# EAGLE design ud100v1 (EAGLE 9.6.2)
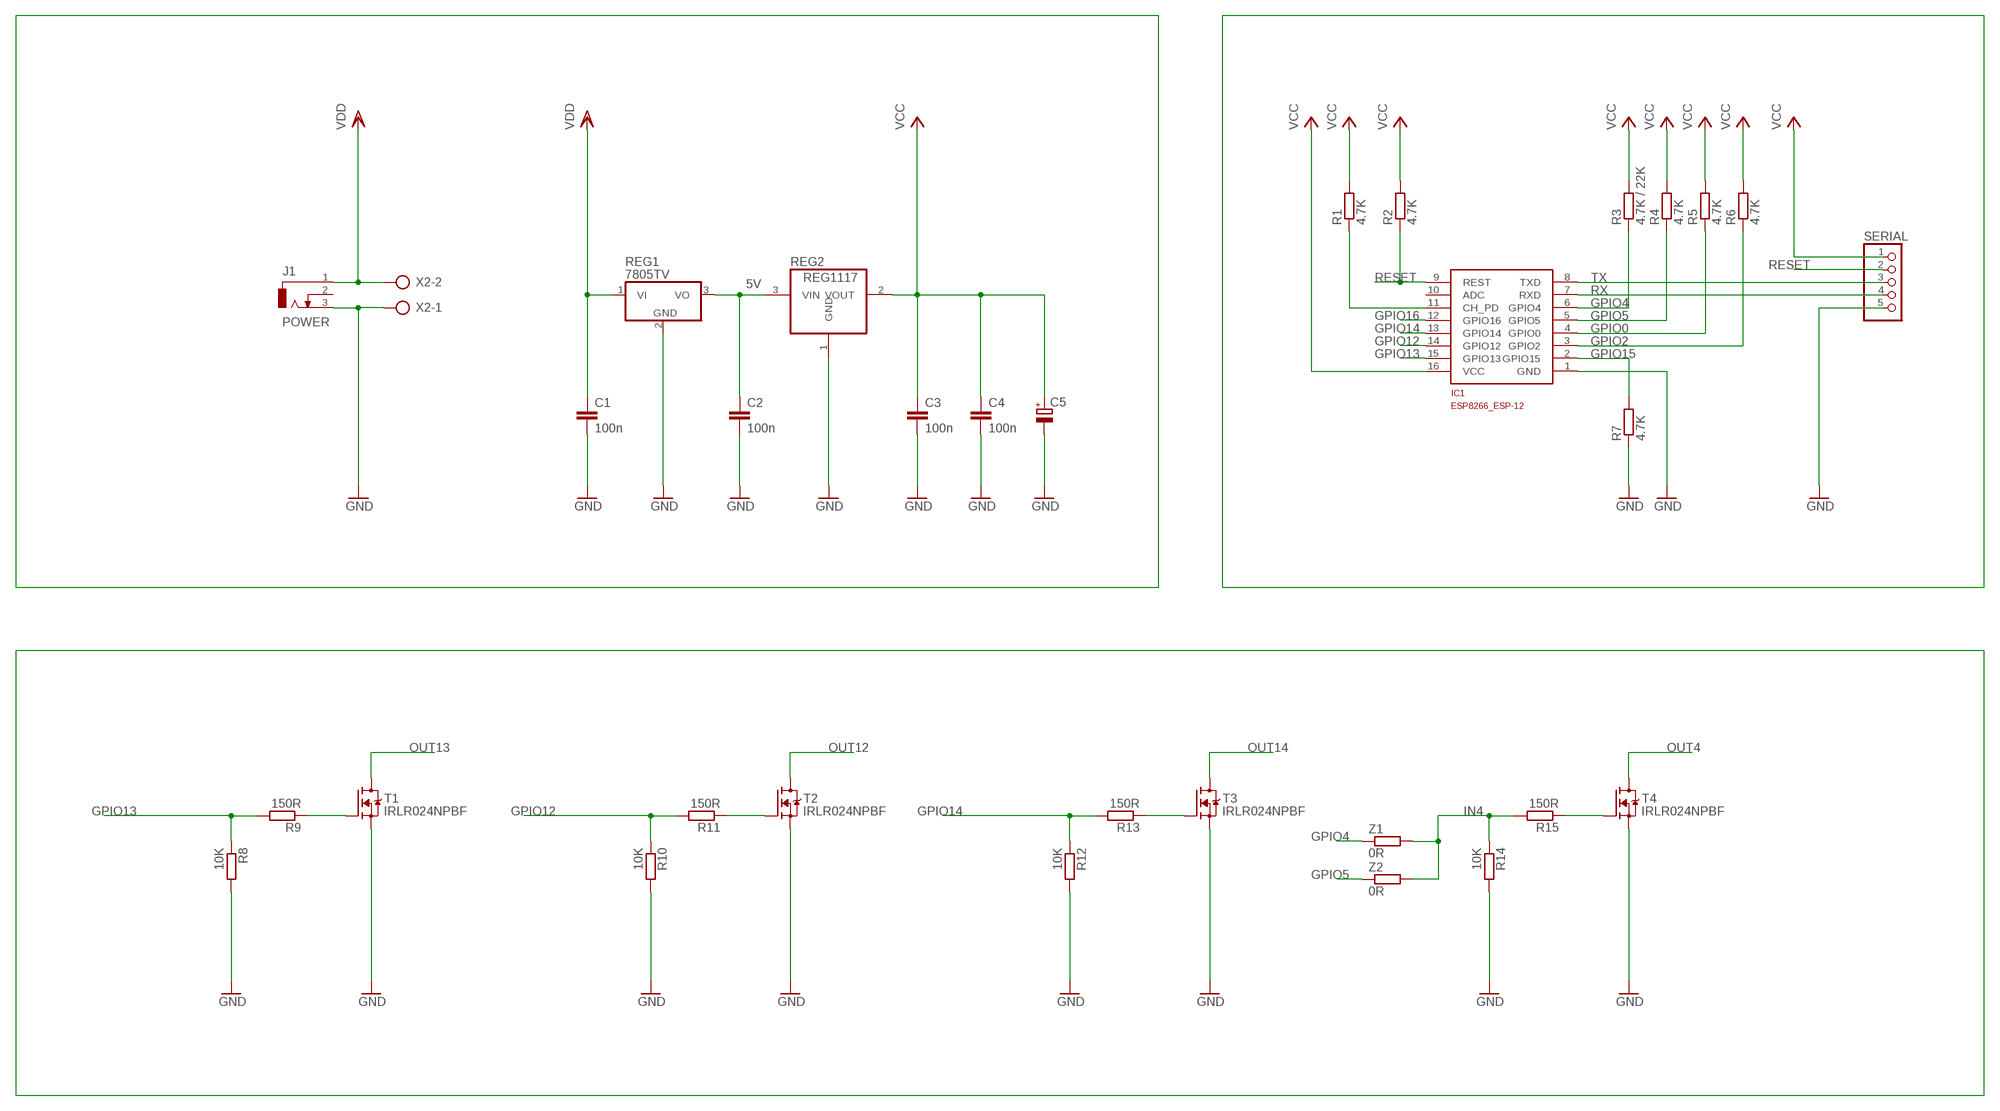
[diagram p0: schematic, sheet 1, part 1 of 2]
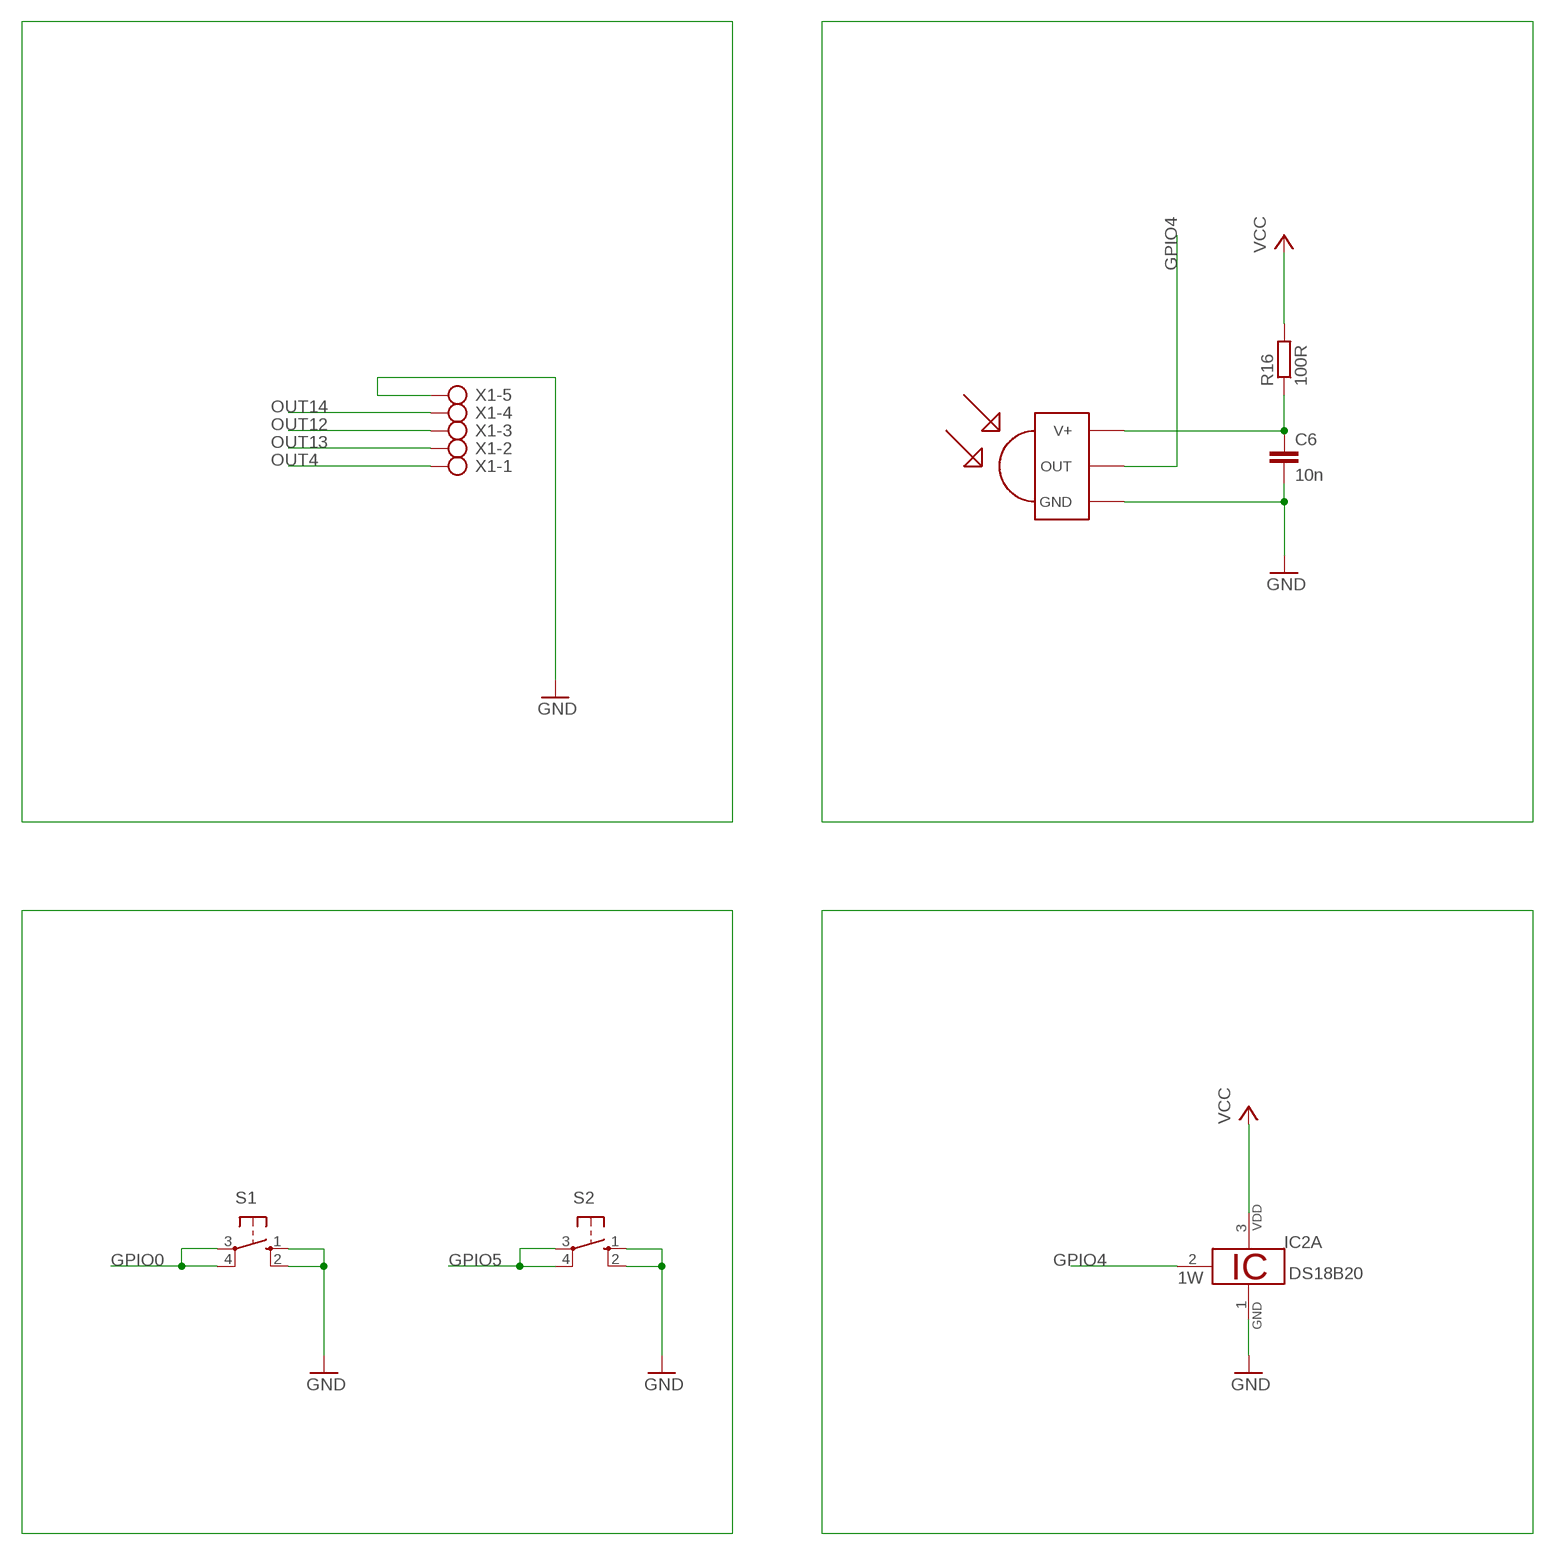
[diagram p1: schematic, sheet 1, part 2 of 2]

## Parts
C1  100n  C-EUC1206  [C1206]
C2  100n  C-EUC1206  [C1206]
C3  100n  C-EUC1206  [C1206]
C4  100n  C-EUC1206  [C1206]
C5  CPOL-EUUD-6,3X8,8  [UD-6,3X5,8_NICHICON]
C6  10n  C-EUC1206  [C1206]
IC1  ESP8266_ESP-12  [ESP8266-ESP12]
IC2  DS18B20  [TO92-]
J1  POWER  DCJ0303  [DCJ0303]
R1  4.7K  R-EU_R1206  [R1206]
R2  4.7K  R-EU_R1206  [R1206]
R3  4.7K / 22K  R-EU_R1206  [R1206]
R4  4.7K  R-EU_R1206  [R1206]
R5  4.7K  R-EU_R1206  [R1206]
R6  4.7K  R-EU_R1206  [R1206]
R7  4.7K  R-EU_R1206  [R1206]
R8  10K  R-EU_R1206  [R1206]
R9  150R  R-EU_R1206  [R1206]
R10  10K  R-EU_R1206  [R1206]
R11  150R  R-EU_R1206  [R1206]
R12  10K  R-EU_R1206  [R1206]
R13  150R  R-EU_R1206  [R1206]
R14  10K  R-EU_R1206  [R1206]
R15  150R  R-EU_R1206  [R1206]
R16  100R  R-EU_R1206  [R1206]
REG1  7805TV  [TO220V]
REG2  REG1117  [SOT223]
S1  10-XX  [B3F-10XX]
S2  10-XX  [B3F-10XX]
SERIAL  PINHD-1X5  [1X05]
T1  IRLR024NPBF  MOSFET-N-DPAK  [DPAK_TO252]
T2  IRLR024NPBF  MOSFET-N-DPAK  [DPAK_TO252]
T3  IRLR024NPBF  MOSFET-N-DPAK  [DPAK_TO252]
T4  IRLR024NPBF  MOSFET-N-DPAK  [DPAK_TO252]
U$1  TSOP1736  [TSOP17XX]
X1  AK500/5  [AK500/5]
X2  AK500/2  [AK500/2]
Z1  0R  R-EU_R0805  [R0805]
Z2  0R  R-EU_R0805  [R0805]

## Nets
5V: C2.1 REG1.3(VO) REG2.3(VIN)
GND: C1.2 C2.2 C3.2 C4.2 C5.- C6.2 IC1.1(GND) IC2.1 J1.3 R7.1 R8.2 R10.2 R12.2 R14.2 REG1.2(GND) REG2.1(GND) S1.1(S) S1.2(S1) S2.1(S) S2.2(S1) SERIAL.5 T1.3(S) T2.3(S) T3.3(S) T4.3(S) U$1.GND X1.5 X2.1
GPIO0: IC1.4(GPIO0) R5.1 S1.3(P) S1.4(P1)
GPIO2: IC1.3(GPIO2) R6.1
GPIO4: IC1.6(GPIO4) IC2.2 R3.1 U$1.OUT Z1.1
GPIO5: IC1.5(GPIO5) R4.1 S2.3(P) S2.4(P1) Z2.1
GPIO12: IC1.14(GPIO12) R10.1 R11.2
GPIO13: IC1.15(GPIO13) R8.1 R9.2
GPIO14: IC1.13(GPIO14) R12.1 R13.2
GPIO15: IC1.2(GPIO15) R7.2
GPIO16: IC1.12(GPIO16)
IN4: R14.1 R15.2 Z1.2 Z2.2
N$3: R15.1 T4.1(G)
N$5: IC1.11(CH_PD) R1.1
N$7: C6.1 R16.1 U$1.V+
N$8: R13.1 T3.1(G)
N$11: R9.1 T1.1(G)
N$13: R11.1 T2.1(G)
OUT4: T4.2(D) X1.1
OUT12: T2.2(D) X1.3
OUT13: T1.2(D) X1.2
OUT14: T3.2(D) X1.4
RESET: IC1.9(REST) R2.1 SERIAL.2
RX: IC1.7(RXD) SERIAL.4
TX: IC1.8(TXD) SERIAL.3
VCC: C3.1 C4.1 C5.+ IC1.16(VCC) IC2.3 R1.2 R2.2 R3.2 R4.2 R5.2 R6.2 R16.2 REG2.2(VOUT) SERIAL.1
VDD: C1.1 J1.1 REG1.1(VI) X2.2
Unconnected: IC1.10(ADC) J1.2

## Library data of the parts
C1-C4 C6 = rcl:C-EU: CAPACITOR, European symbol; SPICEPREFIX: C
C5 = rcl:CPOL-EU: POLARIZED CAPACITOR, European symbol; SPICEPREFIX: C
IC1 = ESP8266-ESP12:ESP8266_ESP-12
IC2 = 1wire:DS18B20: Programmable Resolution Digital Thermometer This chip provides a onewire thermosensor with approx. 0.5°C accuracy. A programmable over/undertemperure alarm is available. The precision can be set from 9..12 bits. Notes: Vdd must be applied for accurate measurements at low temperatures, as the parasite power circuit otherwise heats the sensor. If parasite power is used, Vdd has to be connected to GND. The DS1822 is a low-cost thermometer chip, the DS18S20 is similar to the DS18B20, but with 9 Bit precision only. Author: Jan Kandziora <jjj@gmx.de>
J1 = con-jack:DCJ0303: DC POWER JACK Source: DCJ0303.pdf; OC_FARNELL: unknown; OC_NEWARK: unknown
R1-R16 Z1 Z2 = rcl:R-EU_: RESISTOR, European symbol; SPICEPREFIX: R
REG1 = linear:78*: Positive VOLTAGE REGULATOR Source: http://cache.national.com/ds/LM/LM78L05.pdf http://www.fairchildsemi.com/ds/LM/LM7805.pdf
REG2 = burr-brown:REG1117: 800mA and 1A Low Dropout (LDO) Positive Regulator 1.8V, 2.5V, 2.85V, 3.3V, 5V, and Adj; MPN: REG1117; OC_FARNELL: 1097566; OC_NEWARK: 14P6981
S1 S2 = switch-omron:10-XX: OMRON SWITCH; MPN: B3F-1000; OC_FARNELL: 176432; OC_NEWARK: 36M3542
SERIAL = pinhead:PINHD-1X5: PIN HEADER
T1-T4 = we-transistor:MOSFET-N: N-Channel MOSFET SOT23 N-Chn MOSFET TSM3404, IRLML2502 (Vgs>=+/-20V, Vds<=20V, Id>=3A + Rds<=0.05Ohm @ Vgs=4.5V) BSS138 (Vgs>=+/-20V, Vds<=40V, Id>=0.2A + Rds<=3Ohm @ Vgs=4.5V) SOT223 Low Side Switch with Protection (Infineon) BSP76 (Vin=0...10V, Vds<=42V, Id=1.4A + Rds=0.2Ohm @ Vin=5V) BSP77 (Vin=0...10V, Vds<=42V, Id=2.2A + Rds=0.1Ohm @ Vin=5V) D²Pak Low Side Switch with Protection (Infineon) BTS117TC (Vin=0...10V, Vds<=60V, Id=3.5A + Rds=0.12Ohm @ Vin=5V) BTS133TC (Vin=0...10V, Vds<=60V, Id=7A + Rds=0.06Ohm @ Vin=5V) BTS141TC (Vin=0...10V, Vds<=60V, Id=12A + Rds=0.03Ohm @ Vin=5V) BTS3018TC (Vin=0...10V, Vds<=60V, Id=6A + Rds=0.02Ohm @ Vin=5V)
U$1 = tsop:TSOP1736: IR Receiver and Demodulator
X1 = con-ptr500:AK500/5: CONNECTOR; OC_FARNELL: unknown; OC_NEWARK: unknown
X2 = con-ptr500:AK500/2: CONNECTOR; OC_FARNELL: unknown; OC_NEWARK: unknown

## Board
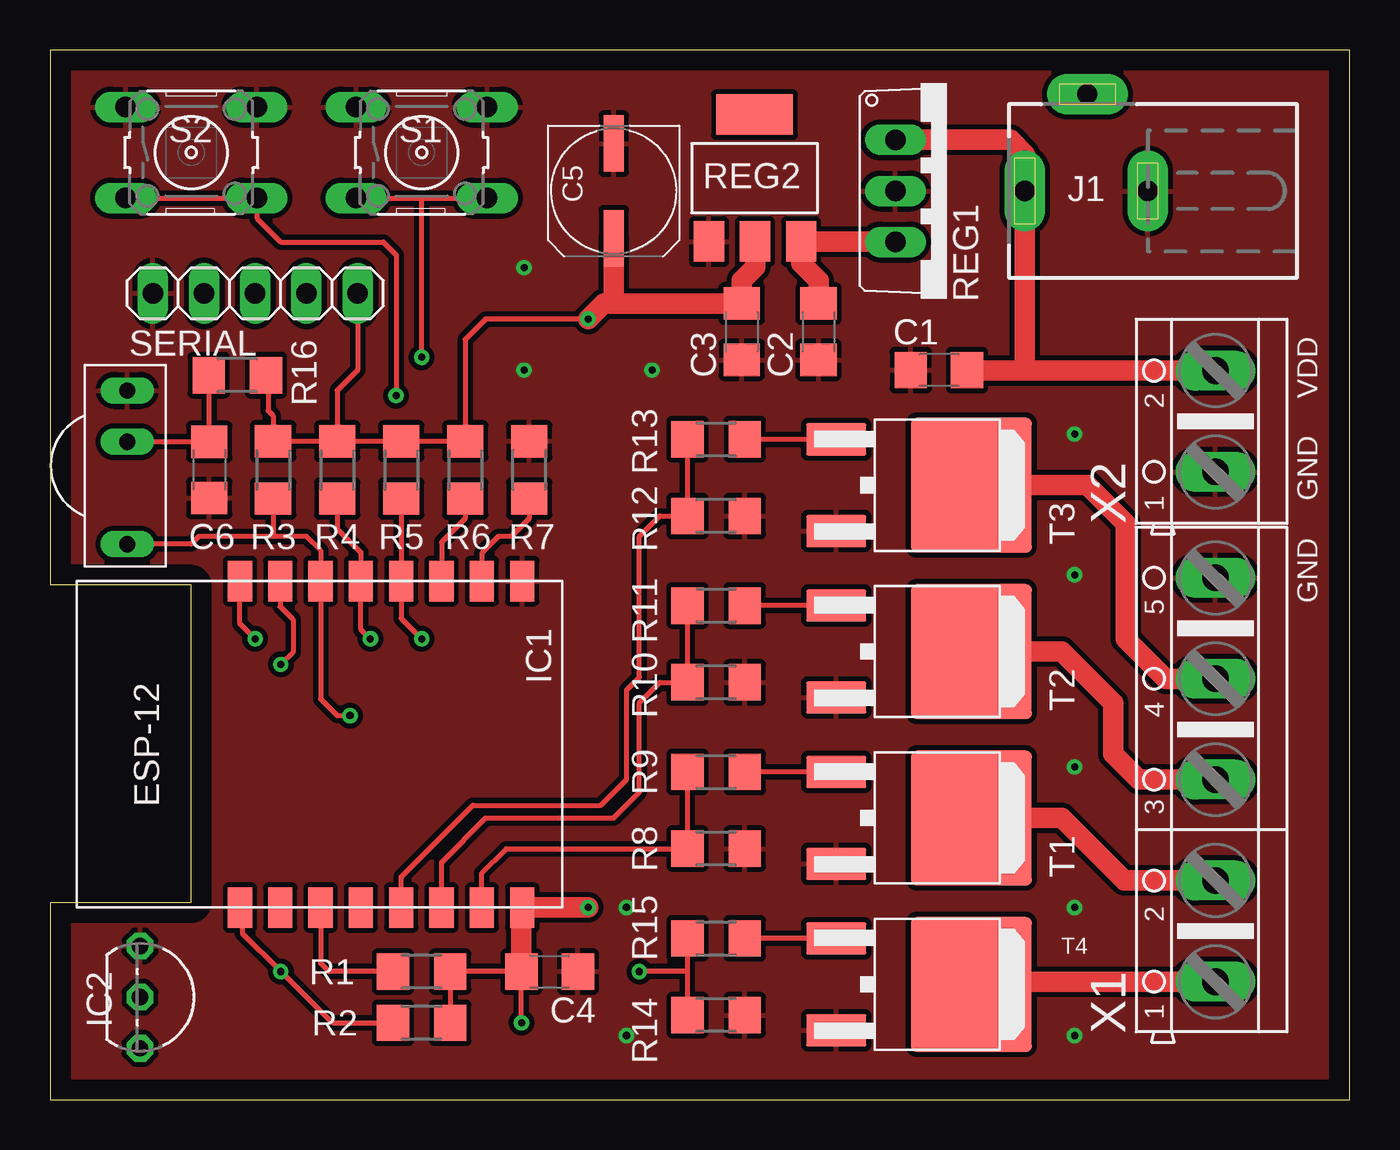
[diagram p2: board, top side]
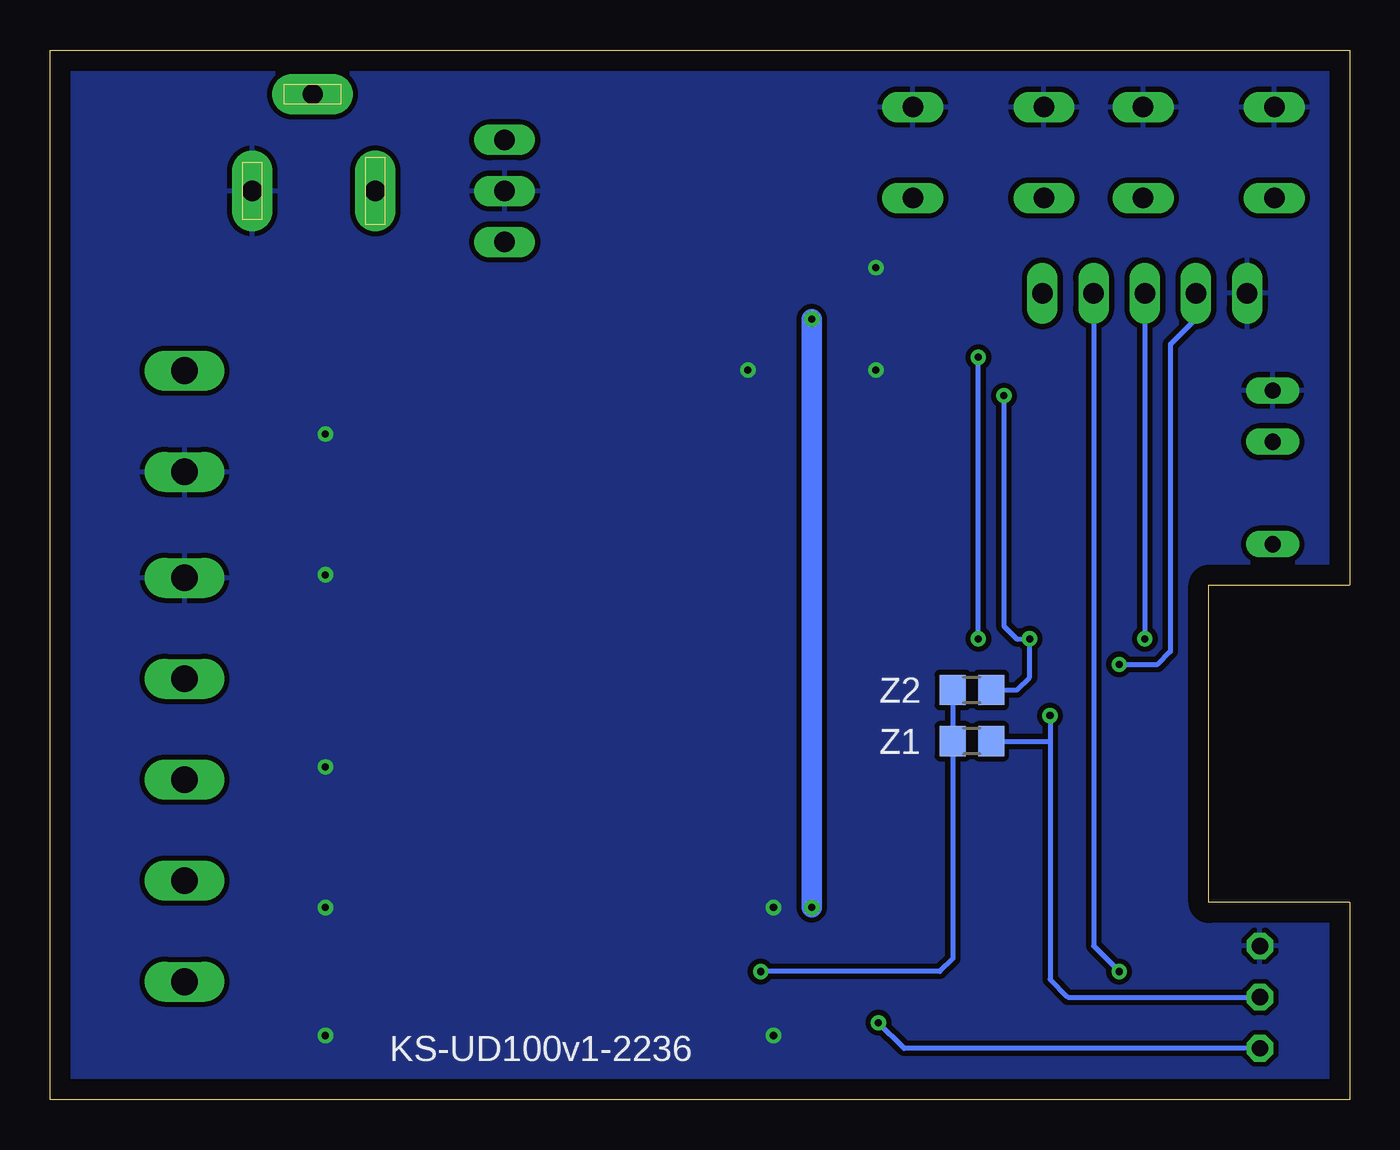
[diagram p3: board, bottom side, seen from below]

Size 64.44 x 52.06 mm. Coordinates in mm from the lower left corner, seen from the top.
Outline: 0,0 64.44,0 64.44,52.06 0,52.06 0,25.53 6.99,25.53 6.99,9.78 0,9.78 0,0
Copper layers (1*16): Top 0.035mm / dielectric 1.5mm / Bottom 0.035mm
Design rules "default *": minimum track width 10mil, minimum drill 0.35mm, track to track 10mil, track to pad 10mil, pad to pad 10mil, via to via 10mil, smd to smd 10mil, copper to edge 40mil, drill to drill 10mil, minimum pad ring 10mil, minimum via ring 8mil, stop-mask expansion 4mil, vias tented up to drill 0mil, thermal gap 10mil

### Footprints (pad centres in the part's own frame; a part is rotated, then mirrored left to right if it is on the bottom)
C1206 = smd 1.6 x 1.8: 1 -1.4,0; 2 1.4,0
UD-6,3X5,8_NICHICON = smd 2.8 x 1: + 2.35,0; - -2.35,0
ESP8266-ESP12 = smd 2 x 1.2: 1 16.2,2; 2 16.2,4; 3 16.2,6; 4 16.2,8; 5 16.2,10; 6 16.2,12; 7 16.2,14; 8 16.2,16; 9 0,16; 10 0,14; 11 0,12; 12 0,10; 13 0,8; 14 0,6; 15 0,4; 16 0,2
TO92- = drill 0.813 octagon: 1 -2.54,0; 2 0,0; 3 2.54,0
DCJ0303 = drill 1 pad 2 long: 1 0,3.1; 2 4.8,0; 3 0,-3
R1206 = smd 1.6 x 1.803: 1 -1.422,0; 2 1.422,0
TO220V = drill 1.016 long: 1 -2.54,-2.54; 2 0,-2.54; 3 2.54,-2.54
SOT223 = smd 1.499 x 2.007: 1 -2.261,-3.15; 2 0.025,-3.15; 3 2.311,-3.15 | smd 3.81 x 2.007: 4 0,3.15
B3F-10XX = drill 1.016 long: 1 -3.251,2.261; 2 3.251,2.261; 3 -3.251,-2.261; 4 3.251,-2.261
1X05 = drill 1.016 long: 1 -5.08,0; 2 -2.54,0; 3 0,0; 4 2.54,0; 5 5.08,0
DPAK_TO252 = smd 3 x 1.6: 1 -4.2,2.28; 3 -4.2,-2.28 | smd 6 x 6.7: 2 2.5,0
TSOP17XX = drill 0.813 long: GND -3.81,0; OUT 3.81,0; V+ -1.27,0
AK500/5 = drill 1.321 long: 1 -10.033,0; 2 -5.004,0; 3 0,0; 4 5.004,0; 5 10.008,0
AK500/2 = drill 1.321 long: 1 -2.515,0; 2 2.515,0
R0805 = smd 1.3 x 1.5: 1 -0.95,0; 2 0.95,0

### Placement (x,y rotation side)
C1  44.07,36.2 180 top
C2  38.1,38.1 270 top
C3  34.29,38.1 270 top
C4  24.77,6.35 0 top
C5  27.94,45.09 270 top
C6  7.87,31.24 270 top
IC1  25.4,9.53 90 top
IC2  4.45,5.08 270 top
J1  51.44,45.09 90 top
R1  18.41,6.35 0 top
R2  18.41,3.81 0 top
R3  11.05,31.24 90 top
R4  14.22,31.24 90 top
R5  17.4,31.24 90 top
R6  20.57,31.24 90 top
R7  23.75,31.24 270 top
R8  33.02,12.45 0 top
R9  33.02,16.26 180 top
R10  33.02,20.7 0 top
R11  33.02,24.51 180 top
R12  33.02,28.96 0 top
R13  33.02,32.77 180 top
R14  33.02,4.19 0 top
R15  33.02,8 180 top
R16  9.27,35.94 0 top
REG1  44.45,45.09 270 top
REG2  34.92,45.72 0 top
S1  18.41,46.99 0 top
S2  6.99,46.99 0 top
SERIAL  10.16,40.01 180 top
T1  43.18,13.97 0 top
T2  43.18,22.23 0 top
T3  43.18,30.48 0 top
T4  43.18,5.71 0 top
U$1  3.81,31.37 270 top
X1  57.78,15.88 90 top
X2  57.78,33.66 90 top
Z1  18.73,17.78 180 bottom
Z2  18.73,20.32 180 bottom

### Tracks (layer width: path | path; a pad name or v marks a point on that pad's centre or on a via)
5V
  Top 1.016: C2.1 38.1,40.64 37.24,41.5 REG2.3 41.88,42.57 REG1.3
GND  (via drill 0.35)
  other vias: 50.8,33.02 50.8,26.04 50.8,16.51 50.8,9.53 50.8,3.17 28.57,9.53 28.57,3.17 29.84,36.2 23.5,36.2 23.5,41.27
  pour Top: 0,0 64.14,0 64.14,52.07 0,52.07 0,26.04 7.62,26.04 7.62,9.53 0,9.53
  pour Bottom: 0,0 64.14,0 64.14,52.07 0,52.07 0,26.04 7.62,26.04 7.62,9.53 0,9.53
GPIO0  (via drill 0.35)
  Top 0.254: S1.3 18.41,44.73 | 18.41,44.73 S1.4 | R5.1 IC1.4 17.4,23.88 v18.41,22.86 | v18.41,36.83 18.41,44.73
  Bottom 0.254: v18.41,22.86 v18.41,36.83
GPIO2
  Top 0.254: R6.1 20.57,28.83 19.4,27.66 IC1.3
GPIO4  (via drill 0.35)
  Top 0.254: R3.1 11.05,27.94 | v14.86,19.05 14.22,19.05 13.4,19.87 IC1.6 13.4,27.24 12.7,27.94 11.05,27.94 | U$1.OUT 6.99,27.56 7.37,27.94 11.05,27.94
  Bottom 0.254: v14.86,19.05 14.86,17.78 | 14.86,17.78 14.86,5.97 13.97,5.08 IC2.2 | Z1.1 14.86,17.78
GPIO5  (via drill 0.35)
  Top 0.254: S2.3 S2.4 10.24,43.74 11.43,42.55 16.51,42.55 17.14,41.91 v17.14,34.92 | R4.1 14.22,28.32 15.4,27.14 IC1.5 15.4,23.34 v15.88,22.86
  Bottom 0.254: v17.14,34.92 17.14,23.5 16.51,22.86 v15.88,22.86 15.88,20.95 16.51,20.32 Z2.1
GPIO12
  Top 0.254: R11.2 R10.1 30.23,20.7 29.21,19.68 29.21,15.24 27.94,13.97 21.59,13.97 19.4,11.78 IC1.14
GPIO13
  Top 0.254: R9.2 R8.1 22.61,12.45 21.4,11.24 IC1.15
GPIO14
  Top 0.254: R13.2 R12.1 30.23,28.96 29.21,27.94 29.21,20.95 28.57,20.32 28.57,15.88 27.3,14.61 20.95,14.61 17.4,11.05 IC1.13
GPIO15
  Top 0.254: R7.2 23.75,28.83 22.86,27.94 22.23,27.94 21.4,27.11 IC1.2
IN4  (via drill 0.35)
  Top 0.254: R15.2 31.6,6.35 | 31.6,6.35 R14.1 | 31.6,6.35 v29.21,6.35
  Bottom 0.254: Z2.2 Z1.2 19.68,6.99 20.32,6.35 v29.21,6.35
N$3
  Top 0.254: T4.1 R15.1
N$5
  Top 0.254: R1.1 13.82,6.35 13.4,6.77 IC1.11
N$7
  Top 0.254: U$1.V+ C6.1 7.87,35.92 R16.1
N$8
  Top 0.254: T3.1 R13.1
N$11
  Top 0.254: T1.1 R9.1
N$13
  Top 0.254: T2.1 R11.1
OUT4
  Top 1.016: X1.1 45.81,5.84 T4.2
OUT12
  Top 1.016: T2.2 50.16,22.23 52.7,19.68 52.7,17.14 53.98,15.88 X1.3
OUT13
  Top 1.016: T1.2 50.16,13.97 53.26,10.87 X1.2
OUT14
  Top 1.016: T3.2 51.44,30.48 53.34,28.57 53.34,22.86 55.32,20.88 X1.4
RESET  (via drill 0.35)
  Top 0.254: IC1.9 9.53,9.4 9.53,8.26 v11.43,6.35 12.06,5.71 13.97,3.81 R2.1
  Bottom 0.254: SERIAL.2 12.7,7.62 v11.43,6.35
RX  (via drill 0.35)
  Top 0.254: IC1.7 11.4,24.45 12.04,23.82 12.04,22.2 v11.43,21.59
  Bottom 0.254: v11.43,21.59 9.53,21.59 8.89,22.23 8.89,37.47 7.62,38.73 SERIAL.4
TX  (via drill 0.35)
  Top 0.254: v10.16,22.86 9.4,23.62 IC1.8
  Bottom 0.254: SERIAL.3 v10.16,22.86
VCC  (via drill 0.35)
  Top 0.254: R4.2 R5.2 R6.2 20.57,37.72 21.59,38.73 v26.67,38.73 | R2.2 R1.2 C4.1 v23.36,3.81 v23.37,3.81 | SERIAL.1 15.24,36.2 14.22,35.18 R4.2 | R16.2 10.79,35.84 10.79,34.19 11.05,33.93 R3.2 R4.2
  Top 1.016: REG2.2 34.95,41.3 34.29,40.64 C3.1 27.94,39.5 | C5.+ 27.94,39.5 | C4.1 23.36,9.49 IC1.16 v26.67,9.53 | v26.67,38.73 27.43,39.5 27.94,39.5
  Bottom 0.254: IC2.3 22.1,2.54 v23.37,3.81
  Bottom 1.016: v26.67,9.53 v26.67,38.73
VDD
  Top 1.016: X2.2 48.26,36.17 | REG1.1 47.62,47.62 48.34,46.91 J1.1 48.34,36.24 48.26,36.17 | 48.26,36.17 45.49,36.17 C1.1

### Text on the board
tNames: VDD | GND | GND
bNames: KS-UD100v1-2236